# EAGLE design MXR MicroAmp (EAGLE 7.1.0)
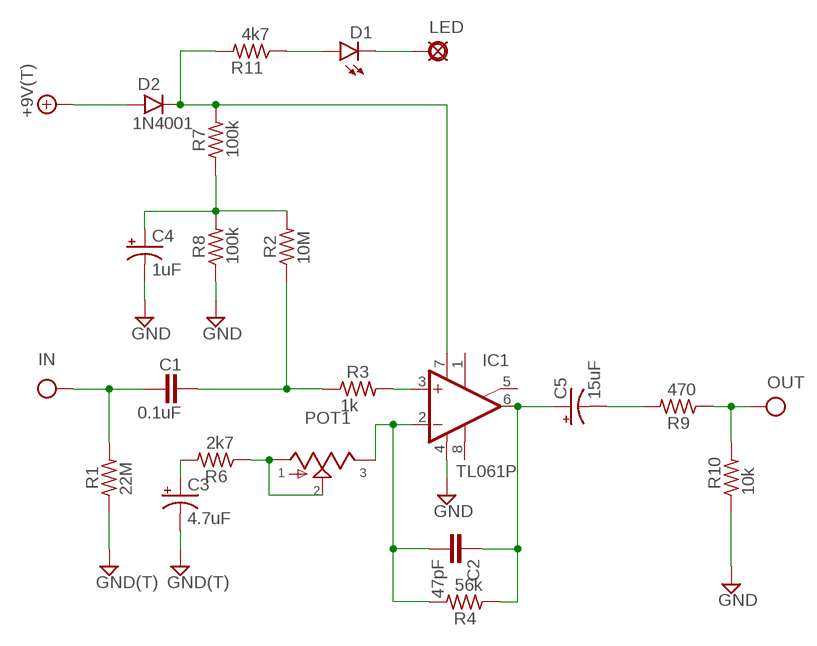
[diagram p0: schematic, sheet 1]

## Parts
+9V  +9V(T)  [SQUARE]
C1  0.1uF  072X0252  [072X025]
C2  47pF  050X030_0251  [050X030_025]
C3  4.7uF  044A1  [044A]
C4  1uF  044A1  [044A]
C5  15uF  0631  [063_025]
D1  LED3MM  [LED3MM]
D2  1N4001  1N400X.1  [DO41-1]
G  GND(T)  [SQUARE]
GND  GND(T)  [SQUARE]
IC1  TL061P  TL071P  [DIL08]
IN  IN(T)  [SQUARE]
LED  LED  PAD  [SQUARE]
OUT  OUT(T)  [SQUARE]
POT1  9MMPOT_9MM_HOLES  [POT_9MM_HOLES]
R1  22M  3MM.2  [R0204/2]
R2  10M  3MM.2  [R0204/2]
R3  1k  3MM.2  [R0204/2]
R4  56k  3MM.2  [R0204/2]
R6  2k7  3MM.2  [R0204/2]
R7  100k  3MM.2  [R0204/2]
R8  100k  3MM.2  [R0204/2]
R9  470  3MM.2  [R0204/2]
R10  10k  3MM.2  [R0204/2]
R11  4k7  3MM.2  [R0204/2]

## Nets
+9V: +9V.1(+9V) D2.A
GND: C3.2(-) C4.2(-) G.1(GND) GND.1(GND) IC1.4(V-) R1.1 R8.1 R10.1
IN: C1.1 IN.1(IN) R1.2
N$1: C1.2 R2.1 R3.1
N$2: D2.C IC1.7(V+) R7.2 R11.2
N$3: C4.1(+) R2.2 R7.1 R8.2
N$4: IC1.3(+IN) R3.2
N$5: C2.2 IC1.2(-IN) POT1.P$3 R4.2
N$6: POT1.P$1 POT1.P$2 R6.1
N$7: C3.1(+) R6.2
N$8: C2.1 C5.+ IC1.6(OUT) R4.1
N$9: D1.A R11.1
N$10: D1.K(C) LED.1(PAD)
N$11: C5.- R9.2
OUT: OUT.1(OUT) R9.1 R10.2
Unconnected: IC1.1(ON1) IC1.5(ON2) IC1.8(OPT)

## Library data of the parts
+9V = mb_supply:+9V(T): +9V Voltage Supply use this to hook up +9v throughout a schematic instead of running wire automatically labels the net "+9v" adds a hookup pad to the circuit board
C1 = mb_caps-box:072X025: 1000pF - 0.47uF WIMA MKP2 63, 100V: 1000pF - 0.015uF; MKS2 50V: 0.33 - 0.47uF; 63V: 1000pF - 0.22uF;
C2 = mb_caps-ceramic:050X030_025: 47 - 120pF Xicon Ceramic Disc 2.5mm lead spacing
C3 C4 = mb_caps-tant:044A: .1 - 1.5µF Vishay Sprague Tantalex Long/Short (Case Code A); 4.4mm; 0.1" lead spacing 35 WVDC
C5 = mb_caps-electro:063: 33 - 220uF Xicon values at Mouser.com 10V: 220uF; 16V: 100uF; 25V: 100uF; 50V: 33uF
D1 = mb_diodes:LED
D2 = mb_diodes:1N400X: Rectifier Diodes often used in power supply to prevent damage from reverse polarization
G GND = mb_supply:GND(T): Ground use this to hook up ground (GND) throughout a schematic instead of running wire automatically labels the net "GND" adds a hookup pad to the circuit board (you can use several)
IC1 = mb_ics:TL071: OP AMP
IN = mb_supply:IN(T): Input obsolete: use Pad instead and label net shematic input label with circuit board terminal/pad generally used only once on a schematic (because this device labels the net "IN" in the same way as a voltage supply or ground net)
LED = mb_supply:PAD: PAD use this package for pads with any purpose, including input, output, send or return various pad shapes: round, square, octogonal, long, and long offset
OUT = mb_supply:OUT(T): Output obsolete: use Pad instead and label net output label with circuit board terminal/pad usually appears only once on a schematic
POT1 = mb_9mm Pot:9MM
R1-R4 R6-R11 = mb_resistors:3MM: 3mm Resistors Leads spaced 1-6 holes apart for 0.1" perfboard. Suitable for 1/8 watt resistors.

## Board
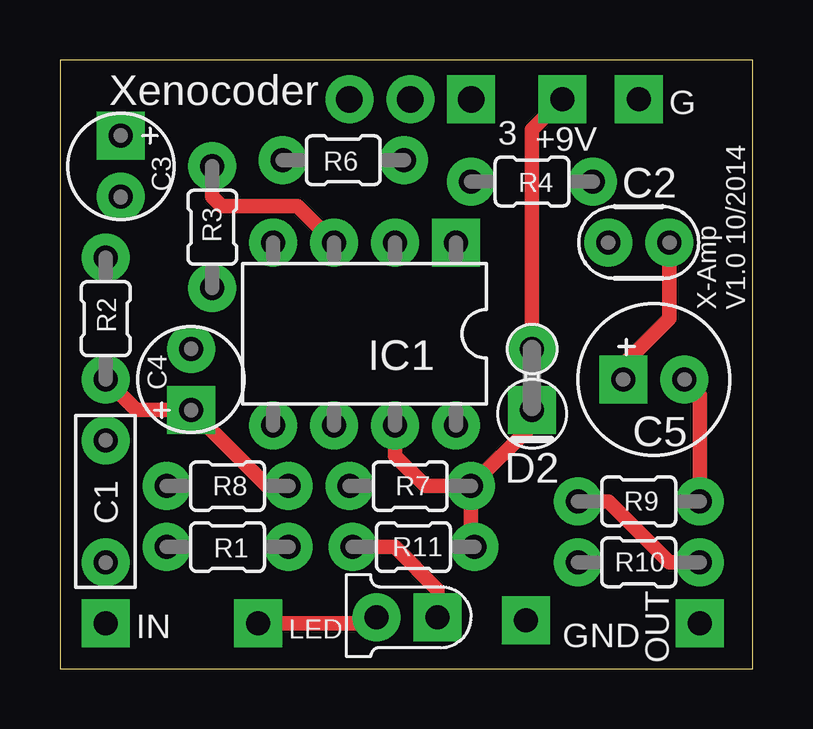
[diagram p1: board, top side]
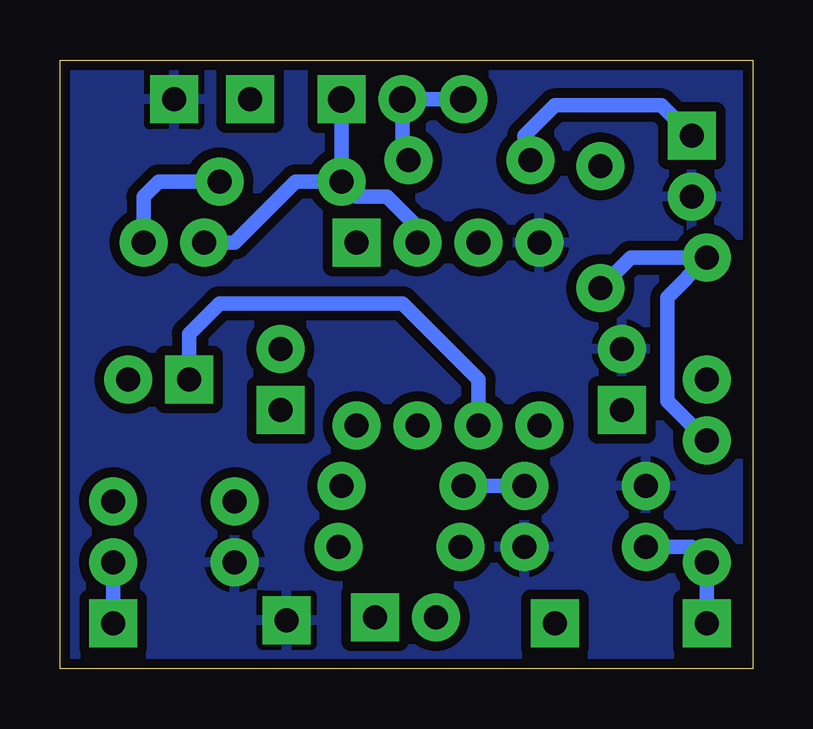
[diagram p2: board, bottom side, seen from below]

Size 28.88 x 25.39 mm. Coordinates in mm from the lower left corner, seen from the top.
Outline: 0,0 28.88,0 28.88,25.39 0,25.39 0,0
Copper layers (1*16): Top 0.0356mm / dielectric 1.5011mm / Bottom 0.0356mm
Design rules "LaenPCBOrder": minimum track width 6mil, minimum drill 13mil, track to track 6mil, track to pad 6mil, pad to pad 6mil, via to via 6mil, smd to smd 6mil, copper to edge 15mil, drill to drill 6mil, minimum pad ring 7mil, minimum via ring 7mil, stop-mask expansion 3mil, vias tented up to drill 0mil, thermal gap 10mil

### Footprints (pad centres in the part's own frame; a part is rotated, then mirrored left to right if it is on the bottom)
SQUARE = drill 1 pad 2 square: 1 0,0
072X025 = drill 1 pad 2: 1 -2.54,0; 2 2.54,0
050X030_025 = drill 1 pad 2: 1 -1.27,0; 2 1.27,0
044A = drill 1 pad 2 square: 1 -1.27,0 | drill 1 pad 2: 2 1.27,0
063_025 = drill 1 pad 2 square: + -1.27,0 | drill 1 pad 2: - 1.27,0
LED3MM = drill 1 pad 2 square: A -1.27,0 | drill 1 pad 2: K 1.27,0
DO41-1 = drill 1 pad 2: A 1.27,0 | drill 1 pad 2 square: C -1.27,0
DIL08 = drill 1 pad 2 square: 1 -3.81,-3.81 | drill 1 pad 2: 2 -1.27,-3.81; 3 1.27,-3.81; 4 3.81,-3.81; 5 3.81,3.81; 6 1.27,3.81; 7 -1.27,3.81; 8 -3.81,3.81
POT_9MM_HOLES = drill 1.1 pad 2: P$1 -2.54,0; P$2 0,0 | drill 1.1 pad 2 square: P$3 2.54,0
R0204/2 = drill 1 pad 2: 1 -2.54,0; 2 2.54,0

### Placement (x,y rotation side)
+9V  20.95,23.75 0 top
C1  1.91,6.99 90 top
C2  24.13,17.78 180 top
C3  2.54,20.95 270 top
C4  5.46,12.06 90 top
C5  24.77,12.06 0 top
D1  14.48,2.16 180 top
D2  19.68,12.06 90 top
G  24.13,23.75 0 top
GND  19.43,2.03 0 top
IC1  12.7,13.97 180 top
IN  1.91,1.91 0 top
LED  8.26,1.91 0 top
OUT  26.67,1.91 0 top
POT1  14.61,23.75 0 top
R1  6.99,5.08 180 top
R2  1.91,14.61 270 top
R3  6.35,18.41 90 top
R4  19.68,20.32 180 top
R6  11.81,21.21 180 top
R7  14.61,7.62 0 top
R8  6.99,7.62 0 top
R9  24.13,6.99 0 top
R10  24.13,4.45 0 top
R11  14.73,5.08 0 top

### Tracks (layer width: path | path; a pad name or v marks a point on that pad's centre or on a via)
+9V
  Top 0.61: D2.A 19.68,22.48 +9V.1
GND
  pour Bottom (isolate 0.406): 0,25.4 28.57,25.4 29.21,0 0,0
IN
  Bottom 0.61: IN.1 C1.1 2.54,5.08 R1.2
N$1
  Bottom 0.61: R3.1 5.08,17.14 R2.1 3.56,15.49 3.56,11.18 C1.2
N$2
  Top 0.61: R7.2 19.68,10.16 D2.C | R7.2 15.24,7.62 13.97,8.89 IC1.7 | R7.2 17.14,5.21 R11.2
N$3
  Top 0.61: R2.2 3.17,10.79 C4.1 8.64,7.62 R8.2
  Bottom 0.61: R7.1 R8.2
N$4
  Top 0.61: IC1.3 9.91,19.3 6.73,19.3 6.35,19.68 R3.2
N$5
  Bottom 0.61: POT1.P$3 R4.2 | IC1.2 13.97,18.41 15.24,19.68 16.51,19.68 R4.2 | R4.2 19.05,20.32 21.59,17.78 C2.2
N$6
  Bottom 0.61: POT1.P$1 POT1.P$2 14.61,21.46 R6.1
N$7
  Bottom 0.61: C3.1 3.81,23.5 8.26,23.5 9.53,22.23 9.53,21.46 R6.2
N$8
  Top 0.61: C5.+ 23.5,12.7 25.4,14.61 C2.1
  Bottom 0.61: R4.1 24.77,20.32 25.4,19.68 C2.1 | IC1.6 11.43,12.06 14.61,15.24 22.23,15.24 23.5,13.97 C5.+
N$9
  Top 0.61: D1.A 15.75,3.3 13.97,5.08 R11.1
N$10
  Top 0.61: LED.1 12.95,1.91 D1.K
N$11
  Top 0.61: R9.2 26.67,11.43 C5.-
OUT
  Top 0.61: R9.1 22.86,6.99 25.4,4.45 R10.2
  Bottom 0.61: OUT.1 R10.2

### Text on the board
tPlace: Xenocoder | 3 | X-Amp / V1.0 10/2014